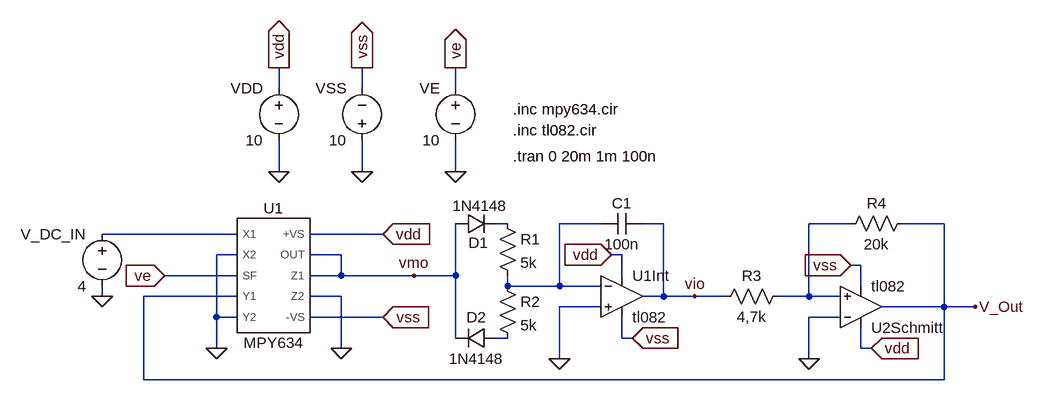
[diagram p0: schematic Versuch_6_3_2.asc]
Versuch_6_3_2.asc, the LTspice schematic file:
Version 4
SHEET 1 1384 680
WIRE 224 -160 224 -192
WIRE 352 -160 352 -192
WIRE 496 -160 496 -192
WIRE 224 -32 224 -80
WIRE 352 -32 352 -80
WIRE 496 -32 496 -80
WIRE 576 48 560 48
WIRE 720 48 656 48
WIRE 816 48 784 48
WIRE 1104 48 1040 48
WIRE 1248 48 1184 48
WIRE 160 64 -48 64
WIRE 384 64 272 64
WIRE 160 96 128 96
WIRE 320 96 272 96
WIRE 752 96 736 96
WIRE 1120 112 1104 112
WIRE 160 128 48 128
WIRE 320 128 320 96
WIRE 320 128 272 128
WIRE 432 128 320 128
WIRE 496 128 496 48
WIRE 496 128 432 128
WIRE 752 128 752 96
WIRE 576 144 576 128
WIRE 656 144 656 48
WIRE 656 144 576 144
WIRE 720 144 656 144
WIRE 1120 144 1120 112
WIRE -48 160 -48 144
WIRE 160 160 16 160
WIRE 320 160 272 160
WIRE 816 160 816 48
WIRE 816 160 784 160
WIRE 864 160 816 160
WIRE 912 160 864 160
WIRE 1040 160 1040 48
WIRE 1040 160 992 160
WIRE 1088 160 1040 160
WIRE 720 176 656 176
WIRE 1248 176 1248 48
WIRE 1248 176 1152 176
WIRE 1296 176 1248 176
WIRE 128 192 128 96
WIRE 160 192 128 192
WIRE 384 192 272 192
WIRE 1088 192 1040 192
WIRE 496 224 496 128
WIRE 576 224 560 224
WIRE 752 224 752 192
WIRE 768 224 752 224
WIRE 128 240 128 192
WIRE 320 240 320 160
WIRE 1120 240 1120 208
WIRE 1136 240 1120 240
WIRE 656 256 656 176
WIRE 1040 256 1040 192
WIRE 16 288 16 160
WIRE 1248 288 1248 176
WIRE 1248 288 16 288
FLAG 224 -32 0
FLAG 352 -32 0
FLAG 656 256 0
FLAG 1040 256 0
FLAG 496 -32 0
FLAG 320 240 0
FLAG 128 240 0
FLAG 48 128 ve
IOPIN 48 128 In
FLAG 384 64 vdd
IOPIN 384 64 In
FLAG 384 192 vss
IOPIN 384 192 In
FLAG 736 96 vdd
IOPIN 736 96 In
FLAG 1136 240 vdd
IOPIN 1136 240 In
FLAG 768 224 vss
IOPIN 768 224 In
FLAG 1104 112 vss
IOPIN 1104 112 In
FLAG 224 -192 vdd
IOPIN 224 -192 Out
FLAG 352 -192 vss
IOPIN 352 -192 Out
FLAG 496 -192 ve
IOPIN 496 -192 Out
FLAG 432 128 vmo
FLAG 864 160 vio
FLAG 1296 176 V_Out
FLAG -48 160 0
SYMBOL voltage 224 -176 M0
SYMATTR InstName VDD
SYMATTR Value 10
SYMBOL voltage 352 -64 R180
WINDOW 0 24 96 Left 2
WINDOW 3 24 16 Left 2
SYMATTR InstName VSS
SYMATTR Value 10
SYMBOL Opamps\\opamp2 752 96 R0
SYMATTR InstName U1Int
SYMATTR Value tl082
SYMBOL Opamps\\opamp2 1120 240 M180
SYMATTR InstName U2Schmitt
SYMATTR Value tl082
SYMBOL cap 784 32 R90
WINDOW 0 0 32 VBottom 2
WINDOW 3 32 32 VTop 2
SYMATTR InstName C1
SYMATTR Value 100n
SYMBOL res 1008 144 R90
WINDOW 0 0 56 VBottom 2
WINDOW 3 32 56 VTop 2
SYMATTR InstName R3
SYMATTR Value 4,7k
SYMBOL res 1200 32 R90
WINDOW 0 0 56 VBottom 2
WINDOW 3 32 56 VTop 2
SYMATTR InstName R4
SYMATTR Value 20k
SYMBOL voltage 496 -176 M0
SYMATTR InstName VE
SYMATTR Value 10
SYMBOL voltage -48 48 M0
WINDOW 123 0 0 Left 0
WINDOW 39 0 0 Left 0
SYMATTR InstName V_DC_IN
SYMATTR Value 4
SYMBOL res 560 32 R0
SYMATTR InstName R1
SYMATTR Value 5k
SYMATTR SpiceLine tol=1 pwr=0.1
SYMBOL res 560 128 R0
SYMATTR InstName R2
SYMATTR Value 5k
SYMATTR SpiceLine tol=1 pwr=0.1
SYMBOL diode 560 208 R90
WINDOW 0 0 32 VBottom 2
WINDOW 3 32 32 VTop 2
SYMATTR InstName D2
SYMATTR Value 1N4148
SYMBOL diode 496 64 R270
WINDOW 0 -29 35 VTop 2
WINDOW 3 59 38 VBottom 2
SYMATTR InstName D1
SYMATTR Value 1N4148
SYMBOL mpy634 208 128 R0
SYMATTR InstName U1
TEXT 584 -96 Left 2 !.inc tl082.cir
TEXT 584 -56 Left 2 !.tran 0 20m 1m 100n
TEXT 584 -128 Left 2 !.inc mpy634.cir

The netlist it stands for:
* Versuch_6_3_2.asc
VDD vdd 0 10
VSS 0 vss 10
XU1Int 0 N002 vdd vss vio tl082  ; pins In+ In- V+ V- OUT
XU2Schmitt N003 0 vdd vss V_Out tl082  ; pins In+ In- V+ V- OUT
C1 vio N002 100n
R3 N003 vio 4,7k
R4 V_Out N003 20k
VE ve 0 10
V_DC_IN N004 0 4
R1 N001 N002 5k tol=1 pwr=0.1
R2 N002 N005 5k tol=1 pwr=0.1
D2 N005 vmo 1N4148
D1 vmo N001 1N4148
XU1 N004 0 ve V_Out 0 vdd vmo vmo 0 vss MPY634  ; pins X1 X2 SF Y1 Y2 +VS OUT Z1 Z2 -VS
.model D D
.lib standard.dio
.inc tl082.cir
.tran 0 20m 1m 100n
.inc mpy634.cir
.lib mpy634.cir
.backanno
.end